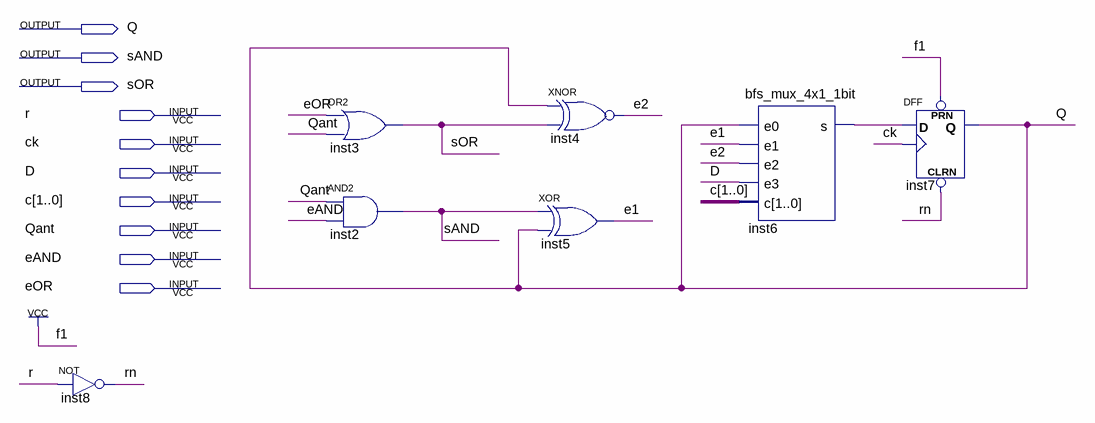
[diagram p0: schematic sheet]
// Quartus schematic bfs_ucg.bdf as structural Verilog: 7 symbols, 10 pins
module bfs_ucg (
  input  r,
  input  ck,
  input  D,
  input  [1:0] c,
  input  Qant,
  input  eAND,
  input  eOR,
  output Q,
  output sAND,
  output sOR
);

  wire e1, e2, inst6_s, rn;

  not inst8 (rn, r);
  or inst3 (sOR, eOR, Qant);
  and inst2 (sAND, Qant, eAND);
  xnor inst4 (e2, Q, sOR);
  xor inst5 (e1, sAND, Q);
  bfs_mux_4x1_1bit inst6 (.e0(Q), .e1(e1), .e2(e2), .e3(D), .c(c), .s(inst6_s));
  DFF inst7 (.CLRN(rn), .CLK(ck), .D(inst6_s), .PRN(1'b1), .Q(Q));
endmodule
